# Altium schematic sheet 22_PHY_GE_PP1.SchDoc
size 419 x 296 mm; Author: Serbinov O.A.; CompanyName: ELSICOM; DrawnBy: Serbinov O.A.; Engineer: Serbinov O.A.; Organization: Elsicom; Address1: Kirova avenue, 58; Address2: Tomsk; Address3: Russia 634012; DocumentNumber: 23; SheetNumber: 23; SheetTotal: 44; ProjectName: 48_PORTS
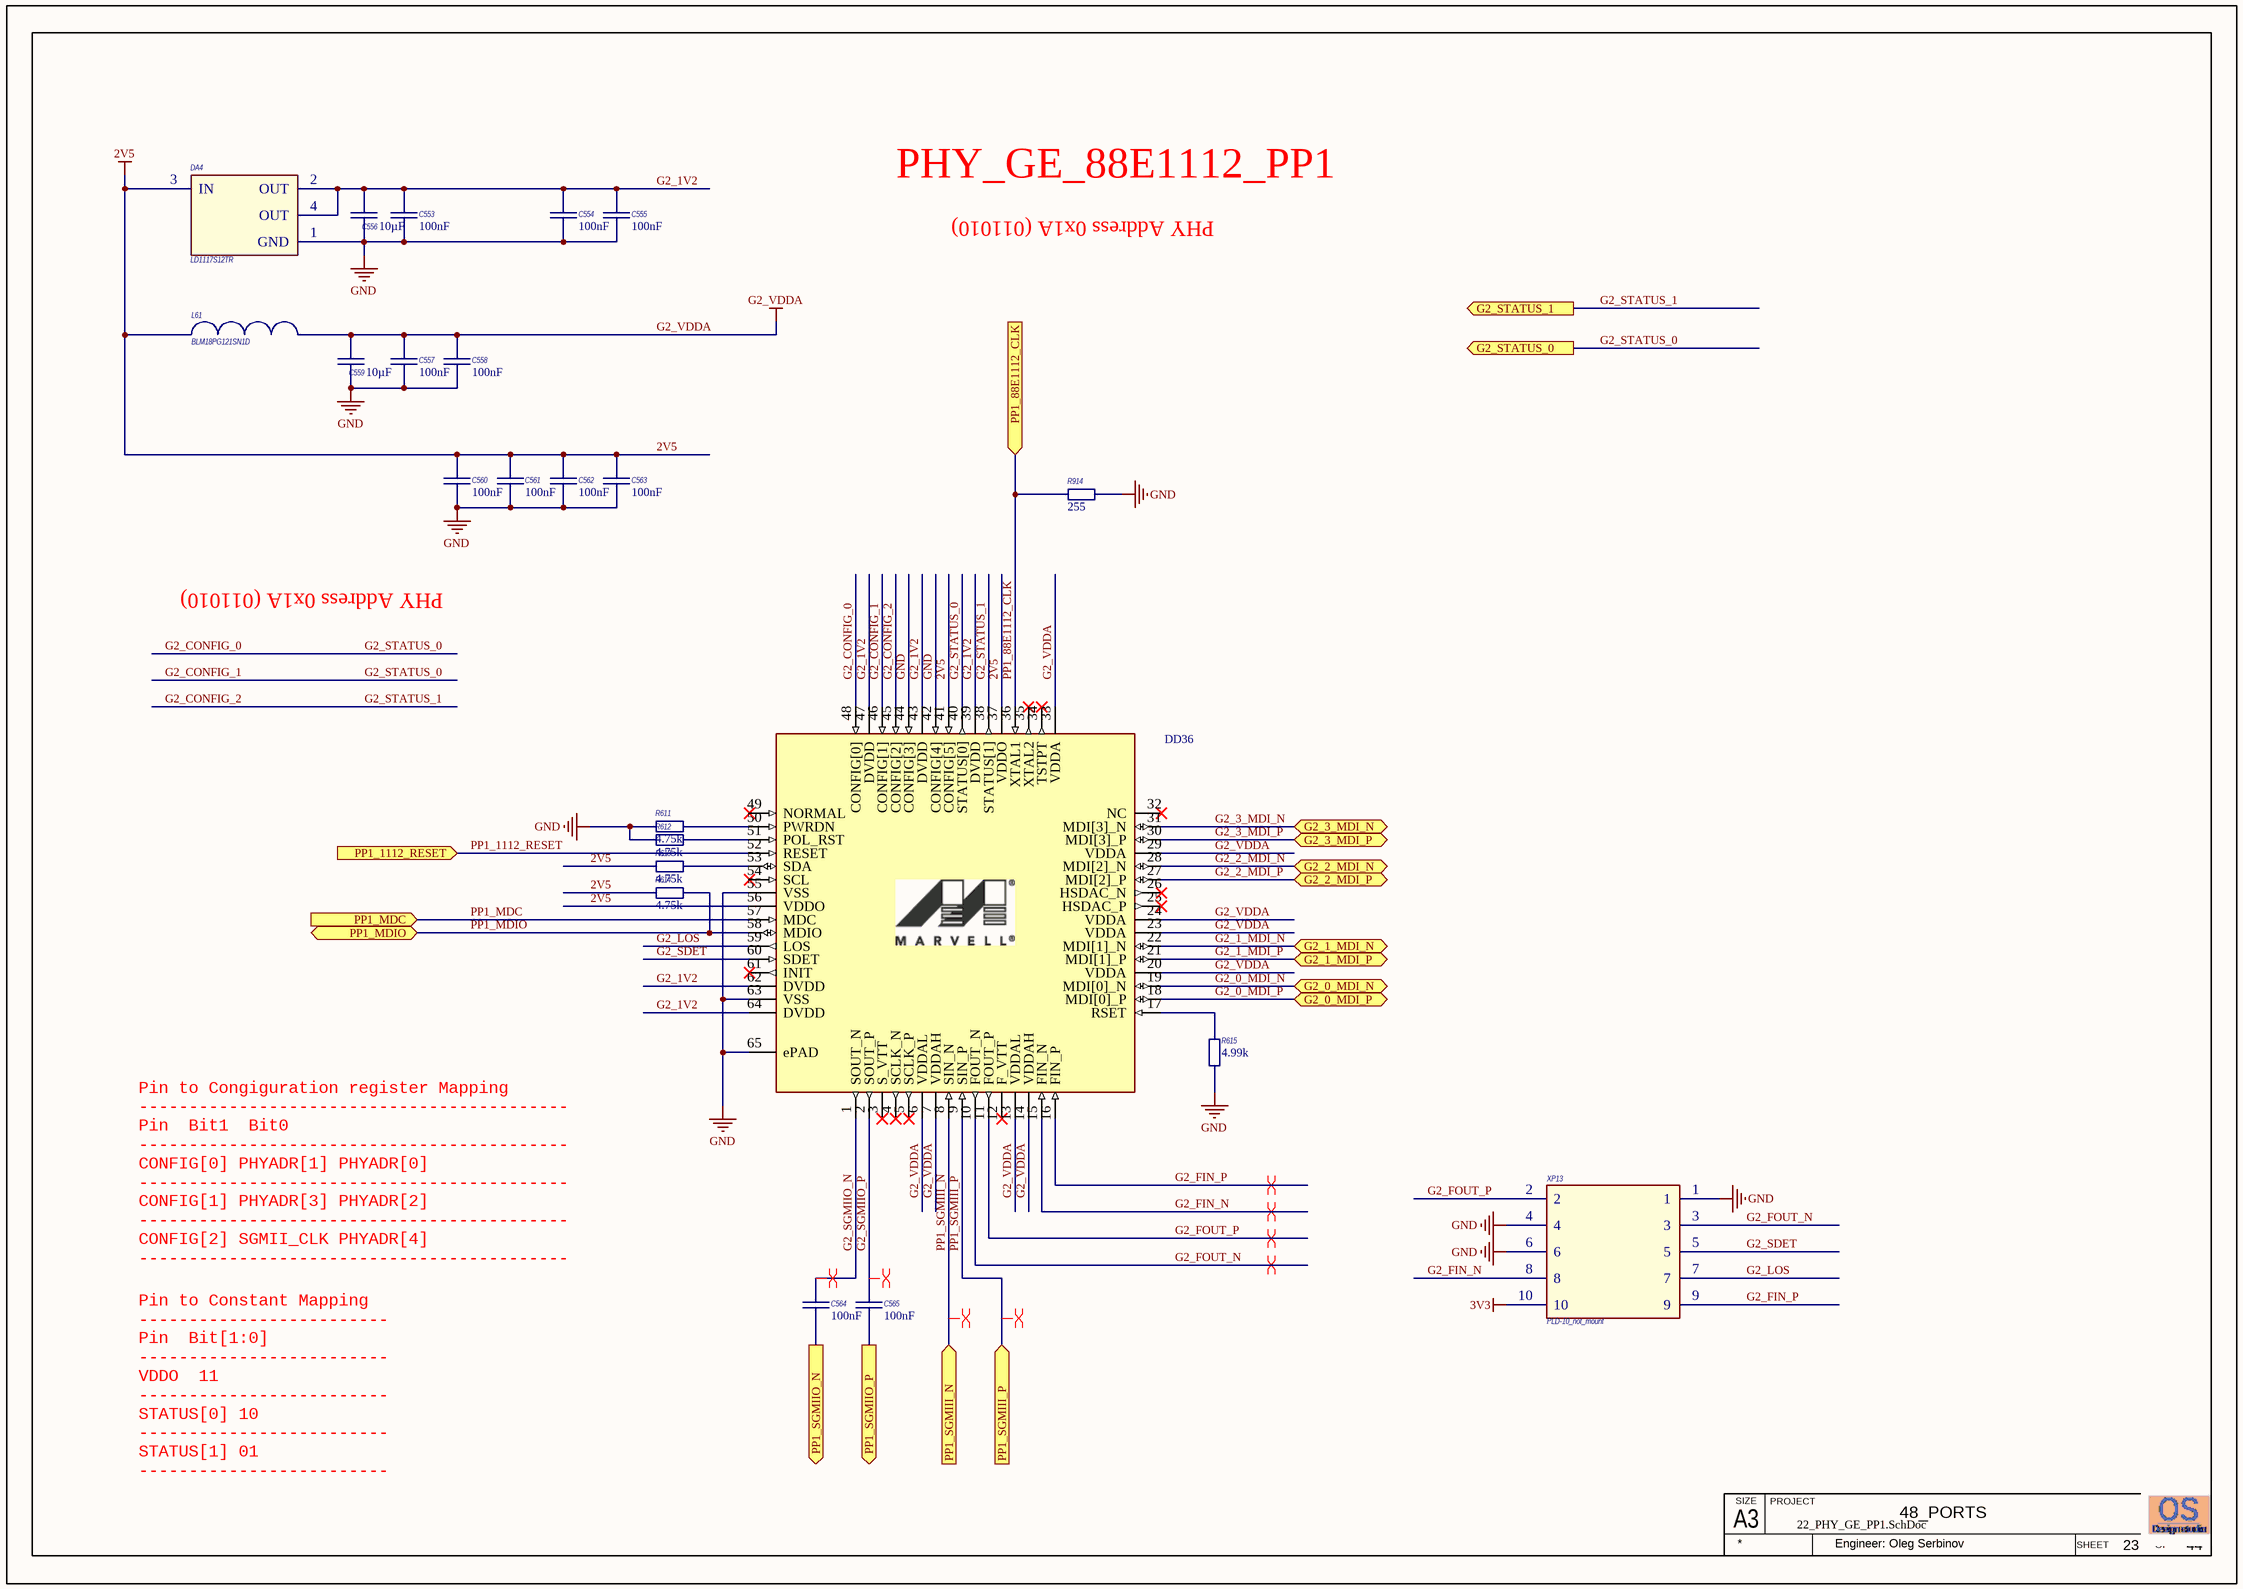
[diagram p0: 22_PHY_GE_PP1.SchDoc]

## Parts
C553  Capacitance: 100nF  [C0402_IPC High Density]  (hidden comment: GRM155R71E104KE14D)
C554  Capacitance: 100nF  [C0402_IPC High Density]  (hidden comment: GRM155R71E104KE14D)
C555  Capacitance: 100nF  [C0402_IPC High Density]  (hidden comment: GRM155R71E104KE14D)
C556  Capacitance: 10µF  [CAPC2012[0805]]  (hidden comment: GRM21BR61C106KE15)
C557  Capacitance: 100nF  [C0402_IPC High Density]  (hidden comment: GRM155R71E104KE14D)
C558  Capacitance: 100nF  [C0402_IPC High Density]  (hidden comment: GRM155R71E104KE14D)
C559  Capacitance: 10µF  [CAPC2012[0805]]  (hidden comment: GRM21BR61C106KE15)
C560  Capacitance: 100nF  [C0402_IPC High Density]  (hidden comment: GRM155R71E104KE14D)
C561  Capacitance: 100nF  [C0402_IPC High Density]  (hidden comment: GRM155R71E104KE14D)
C562  Capacitance: 100nF  [C0402_IPC High Density]  (hidden comment: GRM155R71E104KE14D)
C563  Capacitance: 100nF  [C0402_IPC High Density]  (hidden comment: GRM155R71E104KE14D)
C564  Capacitance: 100nF  [C0402_IPC High Density]  (hidden comment: GRM155R71E104KE14D)
C565  Capacitance: 100nF  [C0402_IPC High Density]  (hidden comment: GRM155R71E104KE14D)
DA4  LD1117S12TR  [SOT223_N]
DD36  88E1112-C2-NNC1  [QFN50P900X900X100-64N]  (value not drawn)
L61  BLM18PG121SN1D  [INDC1608X95N]
R611  Resistance (Ohms): 4.75k  [R0402_IPC High Density]  (hidden comment: ERJ-2RKF4751X)
R612  Resistance (Ohms): 4.75k  [R0402_IPC High Density]  (hidden comment: ERJ-2RKF4751X)
R613  Resistance (Ohms): 4.75k  [R0402_IPC High Density]  (hidden comment: ERJ-2RKF4751X)
R614  Resistance (Ohms): 4.75k  [R0402_IPC High Density]  (hidden comment: ERJ-2RKF4751X)
R615  Resistance (Ohms): 4.99k  [R0402_IPC High Density]  (hidden comment: ERJ-2RKF4991X)
R914  Resistance (Ohms): 255  [RESC1005[0402]]  (hidden comment: ERJ-2RKF2550X)
XP13  PLD-10_not_mount  [PLD-10_not_mount]

## Ports
G2_0_MDI_N (bidir), G2_0_MDI_P (bidir), G2_1_MDI_N (bidir), G2_1_MDI_P (bidir), G2_2_MDI_N (bidir), G2_2_MDI_P (bidir), G2_3_MDI_N (bidir), G2_3_MDI_P (bidir), G2_STATUS_0 (out), G2_STATUS_1 (out), PP1_88E1112_CLK (in), PP1_1112_RESET (in), PP1_MDC (in), PP1_MDIO (bidir), PP1_SGMIII_N (in), PP1_SGMIII_P (in), PP1_SGMIIO_N (out), PP1_SGMIIO_P (out)

## Nets
2V5: C560.2 C561.2 C562.2 C563.2 DA4.3(IN) DD36.37(VDDO) DD36.41(CONFIG[5]) DD36.56(VDDO) L61.1 R613.1 R614.1
3V3: XP13.10
G2_VDDA: C557.2 C558.2 C559.2 DD36.6(VDDAL) DD36.7(VDDAH) DD36.13(VDDAL) DD36.14(VDDAH) DD36.20(VDDA) DD36.23(VDDA) DD36.24(VDDA) DD36.29(VDDA) DD36.33(VDDA) L61.2
GND: C553.1 C554.1 C555.1 C556.1 C557.1 C558.1 C559.1 C560.1 C561.1 C562.1 C563.1 DA4.1(GND) DD36.42(CONFIG[4]) DD36.44(CONFIG[3]) DD36.55(VSS) DD36.63(VSS) DD36.65(ePAD) R611.1 R612.1 R615.1 R914.1 XP13.1 XP13.4 XP13.6
G2_0_MDI_N: DD36.19(MDI[0]_N) ; port G2_0_MDI_N
G2_0_MDI_P: DD36.18(MDI[0]_P) ; port G2_0_MDI_P
G2_1_MDI_N: DD36.22(MDI[1]_N) ; port G2_1_MDI_N
G2_1_MDI_P: DD36.21(MDI[1]_P) ; port G2_1_MDI_P
G2_1V2: C553.2 C554.2 C555.2 C556.2 DA4.2(OUT) DA4.4(OUT) DD36.39(DVDD) DD36.43(DVDD) DD36.47(DVDD) DD36.62(DVDD) DD36.64(DVDD)
G2_2_MDI_N: DD36.28(MDI[2]_N) ; port G2_2_MDI_N
G2_2_MDI_P: DD36.27(MDI[2]_P) ; port G2_2_MDI_P
G2_3_MDI_N: DD36.31(MDI[3]_N) ; port G2_3_MDI_N
G2_3_MDI_P: DD36.30(MDI[3]_P) ; port G2_3_MDI_P
G2_CONFIG_0: DD36.40(STATUS[0]) DD36.46(CONFIG[1]) DD36.48(CONFIG[0]) ; port G2_STATUS_0  [also labelled G2_CONFIG_1, G2_STATUS_0]
G2_CONFIG_2: DD36.38(STATUS[1]) DD36.45(CONFIG[2]) ; port G2_STATUS_1  [also labelled G2_STATUS_1]
G2_FIN_N: DD36.15(FIN_N) XP13.8
G2_FIN_P: DD36.16(FIN_P) XP13.9
G2_FOUT_N: DD36.10(FOUT_N) XP13.3
G2_FOUT_P: DD36.11(FOUT_P) XP13.2
G2_LOS: DD36.59(LOS) XP13.7
G2_SDET: DD36.60(SDET) XP13.5
G2_SGMIIO_N: C564.1 DD36.1(SOUT_N)
G2_SGMIIO_P: C565.1 DD36.2(SOUT_P)
PP1_88E1112_CLK: DD36.36(XTAL1) R914.2 ; port PP1_88E1112_CLK
PP1_1112_RESET: DD36.52(RESET) ; port PP1_1112_RESET
PP1_MDC: DD36.57(MDC) ; port PP1_MDC
PP1_MDIO: DD36.58(MDIO) R614.2 ; port PP1_MDIO
PP1_SGMIII_N: DD36.8(SIN_N) ; port PP1_SGMIII_N
PP1_SGMIII_P: DD36.9(SIN_P) ; port PP1_SGMIII_P
PP1_SGMIIO_N: C564.2 ; port PP1_SGMIIO_N
PP1_SGMIIO_P: C565.2 ; port PP1_SGMIIO_P
NetDD36_17: DD36.17(RSET) R615.2
NetDD36_50: DD36.50(PWRDN) R611.2
NetDD36_51: DD36.51(POL_RST) R612.2
NetDD36_53: DD36.53(SDA) R613.2

Not connected (* = marked no-connect by the designer): DD36 3(S_VTT)* 4(SCLK_N)* 5(SCLK_P)* 12(F_VTT)* 25(HSDAC_P)* 26(HSDAC_N)* 32(NC)* 34(TSTPT)* 35(XTAL2)* 49(NORMAL)* 54(SCL)* 61(INIT)*

## Layout directives
differential pair: G2_FIN_N, G2_FIN_P, G2_FOUT_N, G2_FOUT_P, G2_SGMIIO_N, G2_SGMIIO_P, PP1_SGMIII_N, PP1_SGMIII_P

## Notes on the sheet
- PHY_GE_88E1112_PP1
- PHY Address 0x1A (011010)
- Pin to Congiguration register Mapping
  -------------------------------------------
  Pin		Bit1		Bit0
  -------------------------------------------
  CONFIG[0]	PHYADR[1]	PHYADR[0]
  -------------------------------------------
  CONFIG[1]	PHYADR[3]	PHYADR[2]
  -------------------------------------------
  CONFIG[2]	SGMII_CLK	PHYADR[4]
  -------------------------------------------
  CONFIG[3]	SEL_TWSI	SEL_VTT
  -------------------------------------------
  CONFIG[4]	EEPROM[1]	EEPROM[2]
  ------------------------------------------
- Pin to Constant Mapping
  -------------------------
  Pin		Bit[1:0]
  -------------------------
  VDDO		11
  -------------------------
  STATUS[0]	10
  -------------------------
  STATUS[1]	01
  -------------------------
  VSS		00
  -------------------------
- A3
- SIZE
- PROJECT
- SHEET
- OF
- Engineer: Oleg Serbinov

## Library data of the parts
C553-C555 C557 C558 C560-C565 = GRM155R71E104KE14D: C0402, 100nF, 25V, X7R; Manufacturer: Murata; Rmanufacturer: Yageo  Samsung  TDK  Taiyo Yuden  Kemet; Customer Part Number: Конденсатор, 100n, 0402, 25V, X7R, 10%; Capacitance Tolerance: ± 10%; Voltage Rating: 16; Capacitor Case Style: 0402 [1005 Metric]; Capacitor Terminals: SMD; SVHC: No SVHC (19-Dec-2012); No. of Pins: 2; Reel Quantity: 10000; Tolerance +: 10%; Analogs: any suitable; Manufacturer Part Number: GRM155R71E104KE14D; RoHS: YES; Packaging: Reel; Package / Case: 0402; ComponentLink1URL: http://www.farnell.com/datasheets/4360.pdf; ComponentLink1Description: http://www.farnell.com/datasheets/4360.pdf; Pricing: 10000=0.008593, 30000=0.007991 (GBP); Supplier 1: Farnell; Supplier Part Number 1: 1118151; Stock: 3; Dielectric Characteristic: X7R; Operating Temperature Min: -55; Operating Temperature Max: 125; Operating Temperature Range: -55°C to +125; Series: GRM Hi-Cap; Terminal Type: Surface Mount (SMD, SMT); Tolerance -: 10%; Voltage Rating V DC: 16
C556 C559 = GRM21BR61C106KE15: C0805, 10uF 10%, 16V, X5R; Manufacturer: Murata; Customer Part Number: Конденсатор, 10u, 0805, 16V, X5R, 10%; Analogs: any suitable; Applications: General Purpose; Category: Capacitors; Operating Temperature: -55°C ~ 85°C; Package / Case: 0805 (2012 Metric); Size / Dimension: 0.079" L x 0.049" W (2.00mm x 1.25mm); Temperature Coefficient: X5R; Tolerance: ±10%; ComponentLink1URL: http://search.murata.co.jp/Ceramy/image/img/PDF/ENG/GRM21BR61C106KE15.pdf; ComponentLink1Description: http://search.murata.co.jp/Ceramy/image/img/PDF/ENG/GRM21BR61C106KE15.pdf; Pricing: 1=0.3, 10=0.25, 50=0.1408, 100=0.1252, 250=0.09392, 500=0.08294, 1000=0.07356 (USD); Voltage - Rated: 16V; Manufacturer Part Number: GRM21BR61C106KE15
DA4 = LD1117S12TR: IC REG LDO 0.8A 1.2V SOT223-4; Manufacturer Part Number: LD1117S-12TR; Manufacturer: STMicroelectronics; Customer Part Number: Микросхема, LD1117S-12TR, IC REG LDO 1.2V 0.8A, SOT-223; Reference Voltage: 1.26 V; Input Voltage MAX: 15 V; Input Bias Current (Max): 5 mA; Output Current: 950 mA; Dropout Voltage (Max): 1.1 V; Line Regulation: 0.2 %; Load Regulation: 0.4 %; Maximum Power Dissipation: 12 W; Output Type: Fixed; Number of Outputs: 1; Voltage Regulation Accuracy: 1 %; LD1117S-12TR: LD1117S-12TR (SOT 223, LDO 1.2V 0.8A); Analogs: TLV117112D, LD1117AS12TR, MCP1826S-1202E/DB, AP1122EG-13, ZLDO1117G12TA, AZ1117BH-1.2TRE1; Supplier 1: Mouser; Supplier Part Number 1: 511-LD1117S12; Reeling: True; Minimum Order Quantity: 1; Category: Low Dropout (LDO) Regulators; Mounting Style: SMD/SMT; Supplier Part Number: 511-LD1117S12; Output Voltage: 1.2 V; RoHS: RoHS Compliant; Standard Pack Qty: 2500; RoHS - Mouser: Y; Packaging: Reel; Package / Case: SOT-223; Minimum Operating Temperature: 0 C; Maximum Operating Temperature: + 150 C; Supplier: Mouser; Product Category: Low Drop Voltage Regulators/Drivers; ComponentLink1URL: http://www.st.com/internet/com/TECHNICAL_RESOURCES/TECHNICAL_LITERATURE/DATASHEET/CD00000544.pdf; ComponentLink1Description: http://www.st.com/internet/com/TECHNICAL_RESOURCES/TECHNICAL_LITERATURE/DATASHEET/CD00000544.pdf; Pricing: 1=0.500, 10=0.446, 100=0.378, 250=0.358, 500=0.302, 1000=0.230, 2000=0.203, 2500=0.203, 5000=0.194, 10000=0.188 (AUD)
DD36 = 88E1112-C2-NNC1: IC GIGABIT PHY with Dual SGMII, 64-QFN Package; Manufacturer: Marvell; Manufacturer: Marvell Technology Group; Customer Part Number: Микросхема, 88E1112-C2-NNC1, IC GIGABIT PHY with Dual SGMII, 64-QFN; Manufacturer Part Number: 88E1112-C2-NNC1
L61 = BLM18PG121SN1D: FILTER BLM18 (0603, 2A); Manufacturer: Murata; Rpart number: MPZ1608S121ATAH0 ; CIC10P121NC ; MPZ1608S121ATDH5 ; BLM18PG121SH1D ; 742792625; Rmanufacturer: Boruns  Samsung  TDK  Murata  Wurth Electronics; Customer Part Number: Дроссель, BLM18PG121SN1D, FERRITE BEAD 120 OHM 1LN, 0603; DC Resistance Max: 0.05; Impedance: 120; Ferrite Mounting: SMD; Inductor Type: Ferrite Bead; SVHC: No SVHC (19-Dec-2011); Ferrite Case Style: 0603 / 1608; Core Material: Ferrite; DC Current Max: 2000; Inductor Case Style: 0603; Inductance Tolerance: ± 25%; No. of Pins: 2; RoHS: YES; Operating Temperature Min: -55; Mounting Type: SMD; Operating Temperature Max: +125; Package / Case: 0603; Impedance @ 100MHz Typ: 120; Resistance: 0.05; Supplier Part Number: 1515738; Supplier: Farnell; ComponentLink1URL: http://www.farnell.com/datasheets/5148.pdf; ComponentLink1Description: http://www.farnell.com/datasheets/5148.pdf; Pricing: 5=0.056, 50=0.041, 100=0.034, 250=0.028, 500=0.027 (GBP); Manufacturer Part Number: BLM18PG121SN1D; DC Current Rating: 2A; Analogs: MPZ1608S121ATAH0 ; CIC10P121NC ; MPZ1608S121ATDH5 ; BLM18PG121SH1D ; 742792625
R611-R614 = ERJ-2RKF4751X: R0402, 4.75k 1%; Manufacturer: Panasonic; Rpart number: RC0402FR-074K75L ; RC1005F4751CS ; RMCF0402FT4K75 ; CRCW04024K75FKED ; TRR01MZPF4751; Rmanufacturer: Yageo  Samsung  Stackpole Electronics  Rohm Semiconductor  Vishay Dale; Customer Part Number: Резистор, 4K75, 0402, 1%; Temperature Coefficient: ±100ppm/°C; Power (Watts): 0.1W, 1/10W; Analogs: any suitable; Tolerance: ±1%; Packaging: Cut Tape (CT); Package / Case: 0402 (1005 Metric); Category: Resistors; Manufacturer Part Number: ERJ-2RKF4751X; Supplier Part Number: P4.75KLCT-ND; RoHS: RoHS Compliant; Supplier: Digi-Key; ComponentLink1URL: http://industrial.panasonic.com/www-cgi/jvcr13pz.cgi?E+PZ+3+AOA0002+ERJ2RKF4751X+7+WW; ComponentLink1Description: http://industrial.panasonic.com/www-cgi/jvcr13pz.cgi?E+PZ+3+AOA0002+ERJ2RKF4751X+7+WW; Features: -; Composition: Thick Film; Height: 0.016" (0.40mm); Number of Terminations: 2; Supplier Device Package: 0402; Size / Dimension: 0.039" L x 0.020" W (1.00mm x 0.50mm)
R615 = ERJ-2RKF4991X: R0402, 4.99k 1%; Manufacturer: Panasonic; Customer Part Number: Резистор, 4K99, 0402, 1%; Description 1: RES 4.99K OHM 1/10W 1% 0402 SMD; Category 1: Resistors; Power (Watts): 0.1W, 1/10W; Temperature Coefficient: ±100ppm/°C; Analogs: any suitable; Supplier 1: Digi-Key; Supplier Part Number 1: P4.99KLTR-ND; RoHS 1: RoHS Compliant; Stock 1: 950000; Pricing 1: 10000=0.00347, 30000=0.00305, 50000=0.00279, 100000=0.00274 (USD); Composition: Thick Film; Features: -; Tolerance: ±1%; Package / Case: 0402 (1005 Metric); Size / Dimension: 0.039" L x 0.020" W (1.00mm x 0.50mm); Height: 0.016" (0.40mm); Number of Terminations: 2; Packaging: Tape & Reel (TR); ComponentLink1URL: http://industrial.panasonic.com/www-cgi/jvcr13pz.cgi?E+PZ+3+AOA0002+ERJ2RKF4991X+7+WW; ComponentLink1Description: http://industrial.panasonic.com/www-cgi/jvcr13pz.cgi?E+PZ+3+AOA0002+ERJ2RKF4991X+7+WW; Supplier Part Number: P4.99KLTR-ND; Manufacturer Part Number: ERJ-2RKF4991X; RoHS: RoHS Compliant; Supplier: Digi-Key; Category: Resistors; Pricing: 10000=0.00347, 30000=0.00305, 50000=0.00279, 100000=0.00274 (USD)
R914 = ERJ-2RKF2550X: R0402, 255R 1%; Manufacturer: Panasonic; Customer Part Number: Резистор, 255R, 0402, 1%; Temperature Coefficient: ±100ppm/°C; Power (Watts): 0.1W, 1/10W; Analogs: any suitable; Category: Resistors; Manufacturer Part Number: ERJ-2RKF2550X; Tolerance: ±1%; Packaging: Digi-Reel®; Supplier: Digi-Key; RoHS: RoHS Compliant; Package / Case: 0402 (1005 Metric); ComponentLink1URL: http://industrial.panasonic.com/www-cgi/jvcr13pz.cgi?E+PZ+3+AOA0002+ERJ2RKF2550X+7+WW; ComponentLink1Description: http://industrial.panasonic.com/www-cgi/jvcr13pz.cgi?E+PZ+3+AOA0002+ERJ2RKF2550X+7+WW; Supplier Part Number: P255LDKR-ND; Pricing: 1=0.1, 50=0.0242, 100=0.0184, 250=0.01364, 500=0.01008, 1000=0.00672, 5000=0.00473 (USD); Composition: Thick Film; Number of Terminations: 2; Height: 0.016" (0.40mm); Size / Dimension: 0.039" L x 0.020" W (1.00mm x 0.50mm); Features: -
XP13 = PLD-10_not_mount: Connector PLD-10_not_mount; Customer Part Number: Разъем, PLD-10, 10 Positions Header Shrouded Connector 2.54mm Through Hole Gold; Analogs: any suitable; Manufacturer Part Number: PLD-10_not_mount; Notes: not_mount